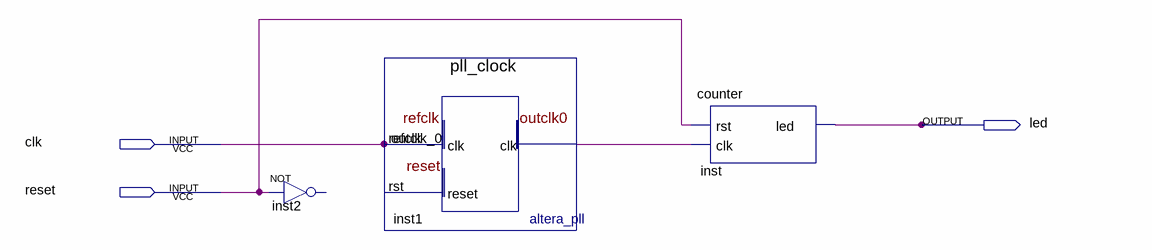
[diagram p0: schematic sheet]
// Quartus schematic blinky.bdf as structural Verilog: 3 symbols, 3 pins
module blinky (
  input  clk,
  input  reset,
  output led
);

  wire inst1_outclk_0;

  // NOT inst2 has open pins: IN=reset, OUT=open
  pll_clock inst1 (.refclk(clk), .outclk_0(inst1_outclk_0));  // open: rst
  counter inst (.rst(reset), .clk(inst1_outclk_0), .led(led));
endmodule
